# EAGLE schematic nanny (EAGLE 7.7.0)
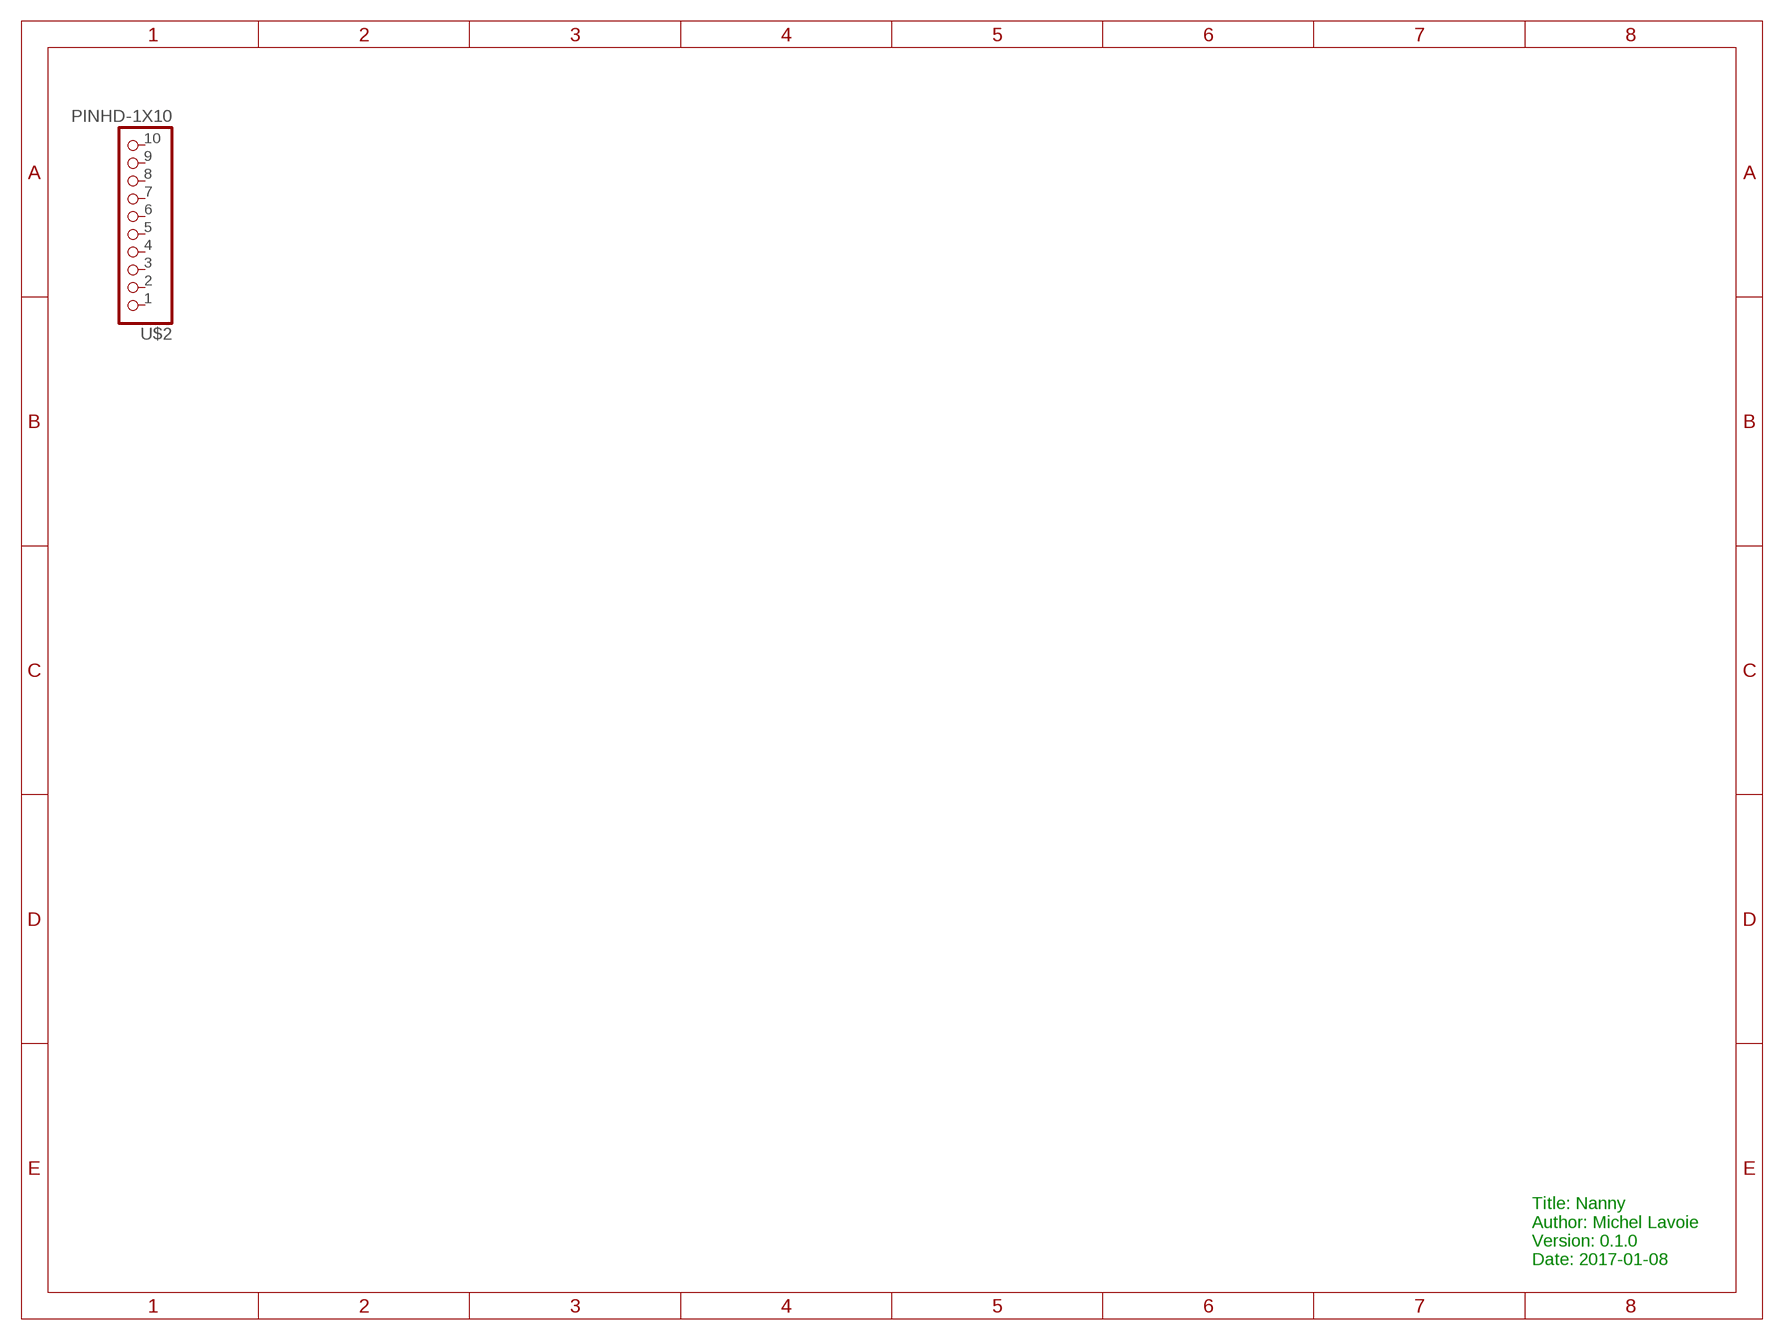
[diagram p0: schematic, sheet 1]

## Parts
U$2  PINHD-1X10  [1X10-BIG]
Unconnected: U$2.1 U$2.2 U$2.3 U$2.4 U$2.5 U$2.6 U$2.7 U$2.8 U$2.9 U$2.10

## Notes on the sheet
- Title: Nanny
  Author: Michel Lavoie
  Version: 0.1.0
  Date: 2017-01-08

## Library data of the parts
U$2 = adafruit:PINHD-1X10: Pin header 1x10 0.1" spacing With round pins